# Altium schematic sheet BANK15.SchDoc: XC7A3G-BANK15
size A4; Date: 9 AUG 2026; Engineer: Parsa Malekpour; Revision: 1.0.0; SheetNumber: 3; SheetTotal: 18
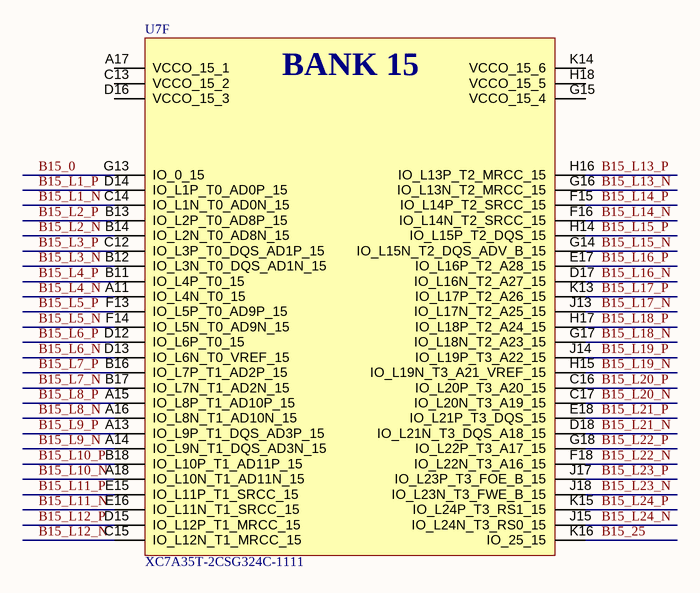
[diagram p0: BANK15.SchDoc]

## Parts
U7  XC7A35T-2CSG324C-1111  [BGA324C80P18X18_1500X1500X150]  (part F of 8)

## Nets
B15_0: U7.G13(IO_0_15)
B15_25: U7.K16(IO_25_15)
B15_L1_N: U7.C14(IO_L1N_T0_AD0N_15)
B15_L1_P: U7.D14(IO_L1P_T0_AD0P_15)
B15_L2_N: U7.B14(IO_L2N_T0_AD8N_15)
B15_L2_P: U7.B13(IO_L2P_T0_AD8P_15)
B15_L3_N: U7.B12(IO_L3N_T0_DQS_AD1N_15)
B15_L3_P: U7.C12(IO_L3P_T0_DQS_AD1P_15)
B15_L4_N: U7.A11(IO_L4N_T0_15)
B15_L4_P: U7.B11(IO_L4P_T0_15)
B15_L5_N: U7.F14(IO_L5N_T0_AD9N_15)
B15_L5_P: U7.F13(IO_L5P_T0_AD9P_15)
B15_L6_N: U7.D13(IO_L6N_T0_VREF_15)
B15_L6_P: U7.D12(IO_L6P_T0_15)
B15_L7_N: U7.B17(IO_L7N_T1_AD2N_15)
B15_L7_P: U7.B16(IO_L7P_T1_AD2P_15)
B15_L8_N: U7.A16(IO_L8N_T1_AD10N_15)
B15_L8_P: U7.A15(IO_L8P_T1_AD10P_15)
B15_L9_N: U7.A14(IO_L9N_T1_DQS_AD3N_15)
B15_L9_P: U7.A13(IO_L9P_T1_DQS_AD3P_15)
B15_L10_N: U7.A18(IO_L10N_T1_AD11N_15)
B15_L10_P: U7.B18(IO_L10P_T1_AD11P_15)
B15_L11_N: U7.E16(IO_L11N_T1_SRCC_15)
B15_L11_P: U7.E15(IO_L11P_T1_SRCC_15)
B15_L12_N: U7.C15(IO_L12N_T1_MRCC_15)
B15_L12_P: U7.D15(IO_L12P_T1_MRCC_15)
B15_L13_N: U7.G16(IO_L13N_T2_MRCC_15)
B15_L13_P: U7.H16(IO_L13P_T2_MRCC_15)
B15_L14_N: U7.F16(IO_L14N_T2_SRCC_15)
B15_L14_P: U7.F15(IO_L14P_T2_SRCC_15)
B15_L15_N: U7.G14(IO_L15N_T2_DQS_ADV_B_15)
B15_L15_P: U7.H14(IO_L15P_T2_DQS_15)
B15_L16_N: U7.D17(IO_L16N_T2_A27_15)
B15_L16_P: U7.E17(IO_L16P_T2_A28_15)
B15_L17_N: U7.J13(IO_L17N_T2_A25_15)
B15_L17_P: U7.K13(IO_L17P_T2_A26_15)
B15_L18_N: U7.G17(IO_L18N_T2_A23_15)
B15_L18_P: U7.H17(IO_L18P_T2_A24_15)
B15_L19_N: U7.H15(IO_L19N_T3_A21_VREF_15)
B15_L19_P: U7.J14(IO_L19P_T3_A22_15)
B15_L20_N: U7.C17(IO_L20N_T3_A19_15)
B15_L20_P: U7.C16(IO_L20P_T3_A20_15)
B15_L21_N: U7.D18(IO_L21N_T3_DQS_A18_15)
B15_L21_P: U7.E18(IO_L21P_T3_DQS_15)
B15_L22_N: U7.F18(IO_L22N_T3_A16_15)
B15_L22_P: U7.G18(IO_L22P_T3_A17_15)
B15_L23_N: U7.J18(IO_L23N_T3_FWE_B_15)
B15_L23_P: U7.J17(IO_L23P_T3_FOE_B_15)
B15_L24_N: U7.J15(IO_L24N_T3_RS0_15)
B15_L24_P: U7.K15(IO_L24P_T3_RS1_15)

Not connected (* = marked no-connect by the designer): U7 A17(VCCO_15_1) C13(VCCO_15_2) D16(VCCO_15_3) G15(VCCO_15_4) H18(VCCO_15_5) K14(VCCO_15_6)

## Notes on the sheet
- TITLE
- REV
- Date
- A4
- FILE NAME
- CODE
- SHEET
- Engineer
- OF
- (in symbol XC7A35T-2CSG324C-1111, part F) BANK 15

## Library data of the parts
U7 = XC7A35T-2CSG324C-1111: Integrated Circuit; Manufacturer_Name: AMD; Datasheet Link: https://www.xilinx.com/support/documentation/data_sheets/ds181_Artix_7_Data_Sheet.pdf; Height: 1.5mm; Manufacturer_Part_Number: XC7A35T-2CSG324C; Mouser Part Number: 217-XC7A35T-2CSG324C; Mouser Price/Stock: https://www.mouser.co.uk/ProductDetail/AMD-Xilinx/XC7A35T-2CSG324C?qs=rrS6PyfT74fMA9%2F3WtPZmw%3D%3D